# EAGLE design breakout_SX1278_blue (EAGLE 8.2.0)
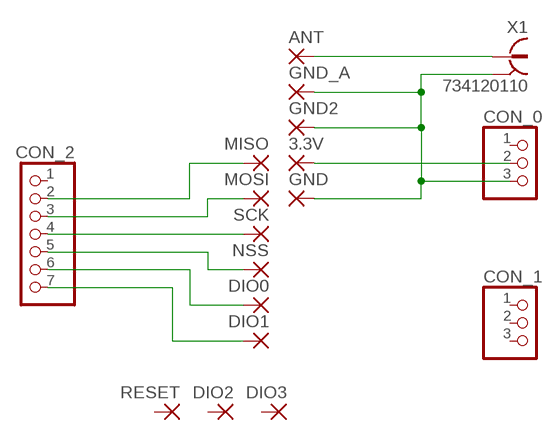
[diagram p0: schematic, sheet 1]

## Parts
3.3V  SMD1  [SMD0,65-1,27]
ANT  SMD1  [SMD0,65-1,27]
CON_0  PINHD-1X3  [1X03]
CON_1  PINHD-1X3  [1X03]
CON_2  PINHD-1X7  [1X07]
DIO0  SMD1  [SMD0,65-1,27]
DIO1  SMD1  [SMD0,65-1,27]
DIO2  SMD1  [SMD0,65-1,27]
DIO3  SMD1  [SMD0,65-1,27]
GND  SMD1  [SMD0,65-1,27]
GND2  SMD1  [SMD0,65-1,27]
GND_A  SMD1  [SMD0,65-1,27]
MISO  SMD1  [SMD0,65-1,27]
MOSI  SMD1  [SMD0,65-1,27]
NSS  SMD1  [SMD0,65-1,27]
RESET  SMD1  [SMD0,65-1,27]
SCK  SMD1  [SMD0,65-1,27]
X1  734120110  [734120110]

## Nets
3.3V: 3.3V.1(P) CON_0.2
ANT: ANT.1(P) X1.1
DIO0: CON_2.6 DIO0.1(P)
DIO1: CON_2.7 DIO1.1(P)
GND: CON_0.3 GND2.1(P) GND.1(P) GND_A.1(P) X1.S@1 X1.S@2 X1.S@3
MISO: CON_2.2 MISO.1(P)
MOSI: CON_2.3 MOSI.1(P)
NSS: CON_2.5 NSS.1(P)
SCK: CON_2.4 SCK.1(P)
Unconnected: CON_0.1 CON_1.1 CON_1.2 CON_1.3 CON_2.1 DIO2.1(P) DIO3.1(P) RESET.1(P)

## Library data of the parts
3.3V ANT DIO0 DIO1-DIO3 GND GND2 GND_A MISO MOSI NSS RESET SCK = wirepad:SMD1: SMD PAD
CON_0 CON_1 = pinhead:PINHD-1X3: PIN HEADER
CON_2 = pinhead:PINHD-1X7: PIN HEADER
X1 = con-coax:734120110: MICRO COAXIAL CONNECTOR RECEPTACLE VERTICAL Source: Data sheet <http://www.molex.com/pdm_docs/sd/734120110_sd.pdf>

## Board
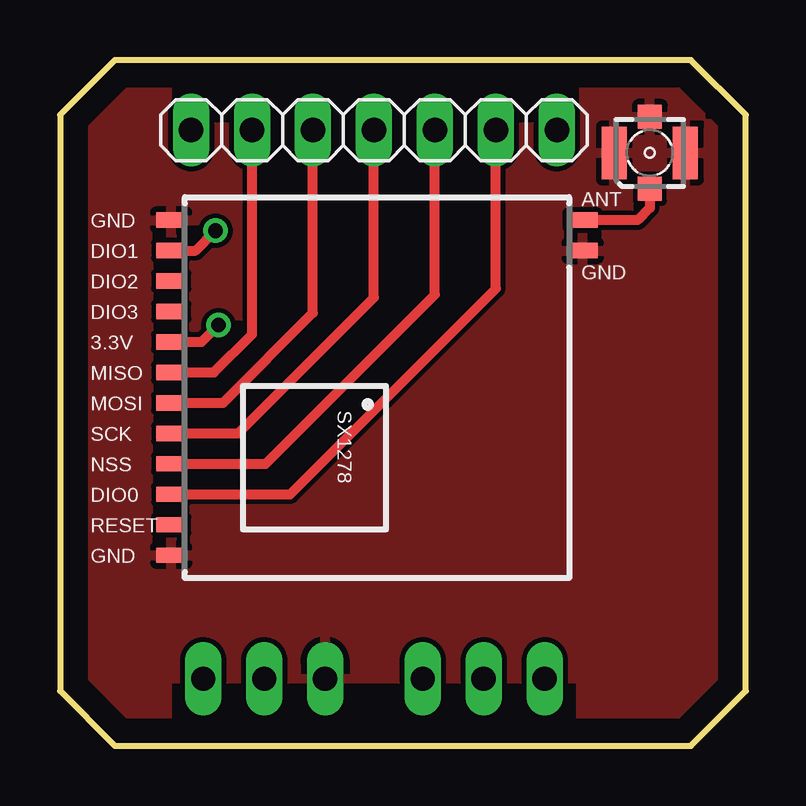
[diagram p1: board, top side]
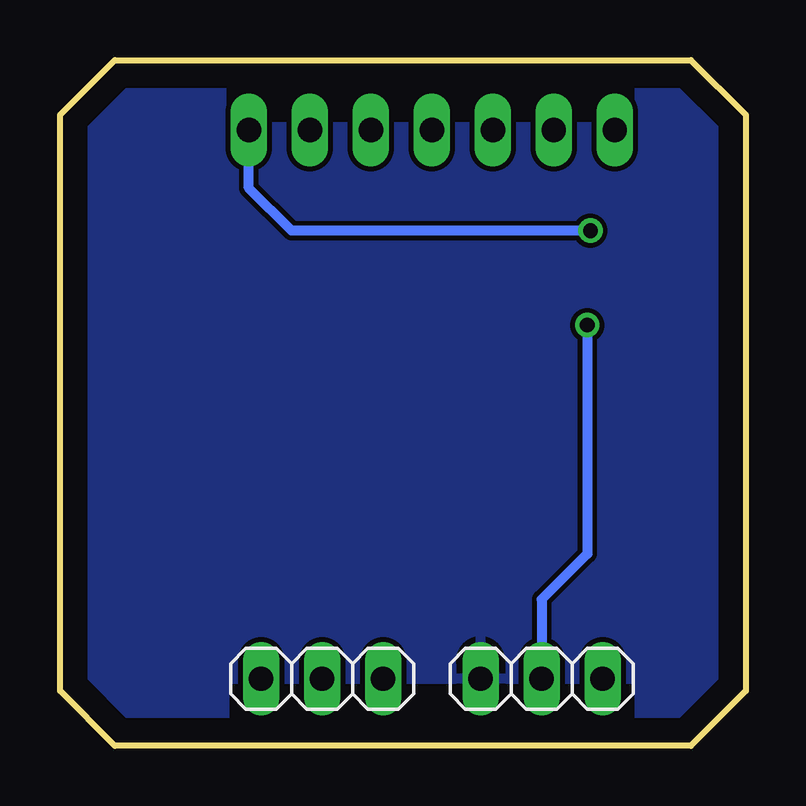
[diagram p2: board, bottom side, seen from below]

Size 28.57 x 28.57 mm. Coordinates in mm from the lower left corner, seen from the top.
Outline: 0,26.29 0,2.29 2.29,0 26.29,0 28.57,2.29 28.57,26.29 26.29,28.57 2.29,28.57 0,26.29
Copper layers (1*16): Top 0.035mm / dielectric 1.5mm / Bottom 0.035mm
Design rules "default *": minimum track width 10mil, minimum drill 24mil, track to track 8mil, track to pad 8mil, pad to pad 8mil, via to via 8mil, smd to smd 8mil, copper to edge 40mil, drill to drill 8mil, minimum pad ring 10mil, minimum via ring 8mil, stop-mask expansion 4mil, vias tented up to drill 0mil, thermal gap 10mil

### Footprints (pad centres in the part's own frame; a part is rotated, then mirrored left to right if it is on the bottom)
SMD0,65-1,27 = smd 0.635 x 1.27: 1 0,0
1X03 = drill 1.016 long: 1 -2.54,0; 2 0,0; 3 2.54,0
1X07 = drill 1.016 long: 1 -7.62,0; 2 -5.08,0; 3 -2.54,0; 4 0,0; 5 2.54,0; 6 5.08,0; 7 7.62,0
734120110 = smd 1 x 1: 1 0,-1.5; S@1 0,1.5 | smd 1.05 x 2.2: S@2 -1.475,0; S@3 1.475,0

### Placement (x,y rotation side)
3.3V  4.64,16.83 270 top
ANT  21.78,21.91 270 top
CON_0  8.51,2.79 180 bottom
CON_1  17.65,2.79 180 bottom
CON_2  13.08,25.65 0 top
DIO0  4.64,10.48 270 top
DIO1  4.64,20.64 270 top
DIO2  4.64,19.37 270 top
DIO3  4.64,18.1 270 top
GND  4.64,21.91 270 top
GND2  4.64,7.94 270 top
GND_A  21.78,20.64 270 top
MISO  4.64,15.56 270 top
MOSI  4.64,14.29 270 top
NSS  4.64,11.75 270 top
RESET  4.64,9.21 270 top
SCK  4.64,13.02 270 top
X1  24.57,24.7 0 top

### Tracks (layer width: path | path; a pad name or v marks a point on that pad's centre or on a via)
3.3V  (via drill 0.61)
  Top 0.406: 3.3V.1 5.91,16.83 v6.6,17.53
  Bottom 0.406: v6.6,17.53 6.6,8 8.51,6.1 CON_0.2
ANT
  Top 0.406: ANT.1 24.07,21.91 24.57,22.42 X1.1
DIO0
  Top 0.406: DIO0.1 9.59,10.48 18.16,19.05 CON_2.6
DIO1  (via drill 0.61)
  Top 0.406: DIO1.1 5.65,20.64 v6.48,21.46
  Bottom 0.406: v6.48,21.46 18.92,21.46 20.7,23.24 CON_2.7
GND
  pour Top: 1.65,29.46 4.45,29.46 4.45,25.78 21.84,25.78 21.84,29.46 26.8,29.46 29.46,26.8 29.46,1.65 27.18,-1.02 21.72,-1.02 21.72,2.79 4.45,2.79 4.45,-1.02 2.03,-1.02 -0.89,1.78 -0.89,26.92
  pour Bottom: 1.91,29.08 4.45,29.08 4.45,25.78 21.84,25.78 21.84,29.08 26.54,29.08 29.08,26.54 29.08,1.91 26.67,-0.51 21.72,-0.51 21.72,2.79 4.45,2.79 4.45,-0.51 2.03,-0.51 -0.51,2.03 -0.51,26.67
MISO
  Top 0.406: MISO.1 6.41,15.56 8,17.14 CON_2.2
MOSI
  Top 0.406: MOSI.1 6.79,14.29 10.54,18.03 CON_2.3
NSS
  Top 0.406: NSS.1 8.57,11.75 15.62,18.8 CON_2.5
SCK
  Top 0.406: SCK.1 7.43,13.02 13.08,18.67 CON_2.4

### Text on the board
tNames: GND | SX1278 | GND